# Altium schematic sheet POWER_BOARD.SchDoc
size A4; SheetNumber: 1; SheetTotal: 10
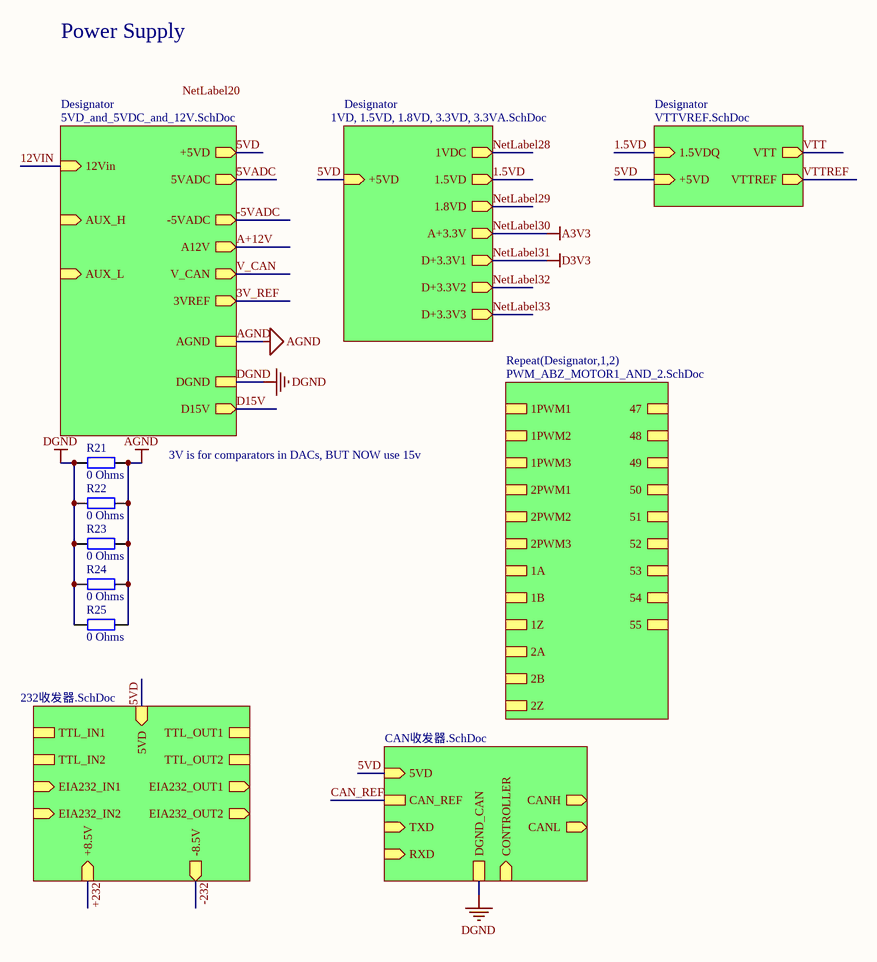
[diagram p0: POWER_BOARD.SchDoc]

## Parts
R21  0 Ohms  [R 0805_L]
R22  0 Ohms  [R 0805_L]
R23  0 Ohms  [R 0805_L]
R24  0 Ohms  [R 0805_L]
R25  0 Ohms  [R 0805_L]

## Sub-sheets
CANH = CAN收发器.SchDoc: 5VD (in), CAN_REF, TXD (in), RXD (in), CONTROLLER (in), CANL (out), CANH (out), DGND_CAN
Designator = 1VD, 1.5VD, 1.8VD, 3.3VD, 3.3VA.SchDoc: +5VD (in), 1VDC (out), 1.5VD (out), 1.8VD (out), A+3.3V (out), D+3.3V1 (out), D+3.3V2 (out), D+3.3V3 (out)
Designator = VTTVREF.SchDoc: 1.5VDQ (in), VTT (out), VTTREF (out), +5VD (in)
Designator = 5VD_and_5VDC_and_12V.SchDoc: +5VD (out), 12Vin (in), 5VADC (out), A12V (out), -5VADC (out), V_CAN (out), 3VREF (out), AGND, DGND, AUX_H (in), AUX_L (in), D15V (out)
Designator = 232收发器.SchDoc: TTL_IN1, TTL_IN2, TTL_OUT1, TTL_OUT2, +8.5V (in), EIA232_IN1 (in), EIA232_IN2 (in), EIA232_OUT1 (out), EIA232_OUT2 (out), 5VD (in), -8.5V (out)
Repeat(Designator,1,2) = PWM_ABZ_MOTOR1_AND_2.SchDoc: 1PWM1, 1PWM2, 1PWM3, 2PWM1, 2PWM2, 2PWM3, 1A, 1B, 1Z, 47, 48, 49, 50, 51, 52, 53, 54, 55, 2A, 2B, 2Z

## Nets
AGND: R21.2 R22.2 R23.2 R24.2 R25.2 ; sheet Designator/AGND
DGND: R21.1 R22.1 R23.1 R24.1 R25.1 ; sheet Designator/DGND, sheet CANH/DGND_CAN
NetLabel30: sheet Designator/A+3.3V  [also labelled A3V3]
NetLabel31: sheet Designator/D+3.3V1  [also labelled D3V3]
1.5VD: sheet Designator/1.5VD, sheet Designator/1.5VDQ
3V_REF: sheet Designator/3VREF
5VADC: sheet Designator/5VADC
5VD: sheet Designator/+5VD, sheet Designator/+5VD, sheet Designator/+5VD, sheet Designator/5VD, sheet CANH/5VD
12VIN: sheet Designator/12Vin
+232: sheet Designator/+8.5V
-5VADC: sheet Designator/-5VADC
-232: sheet Designator/-8.5V
A+12V: sheet Designator/A12V
CAN_REF: sheet CANH/CAN_REF
D15V: sheet Designator/D15V
NetLabel28: sheet Designator/1VDC
NetLabel29: sheet Designator/1.8VD
NetLabel32: sheet Designator/D+3.3V2
NetLabel33: sheet Designator/D+3.3V3
V_CAN: sheet Designator/V_CAN
VTT: sheet Designator/VTT
VTTREF: sheet Designator/VTTREF

## Notes on the sheet
- Power Supply
- 3V is for comparators in DACs, BUT NOW use 15v
- Labels drawn without touching a wire or pin: NetLabel20

## Library data of the parts
R21-R25 = R: 贴片电阻; 版权归属: 来自淘宝 ID：黄晶宝石; 封装库来自淘宝卖家 ID：黄晶宝石: 其他店铺购入均为盗版，不享受售后技术支持服务，请立即申请退款; BOM名称: 贴片电阻; 联系售后: https://shop463601444.taobao.com